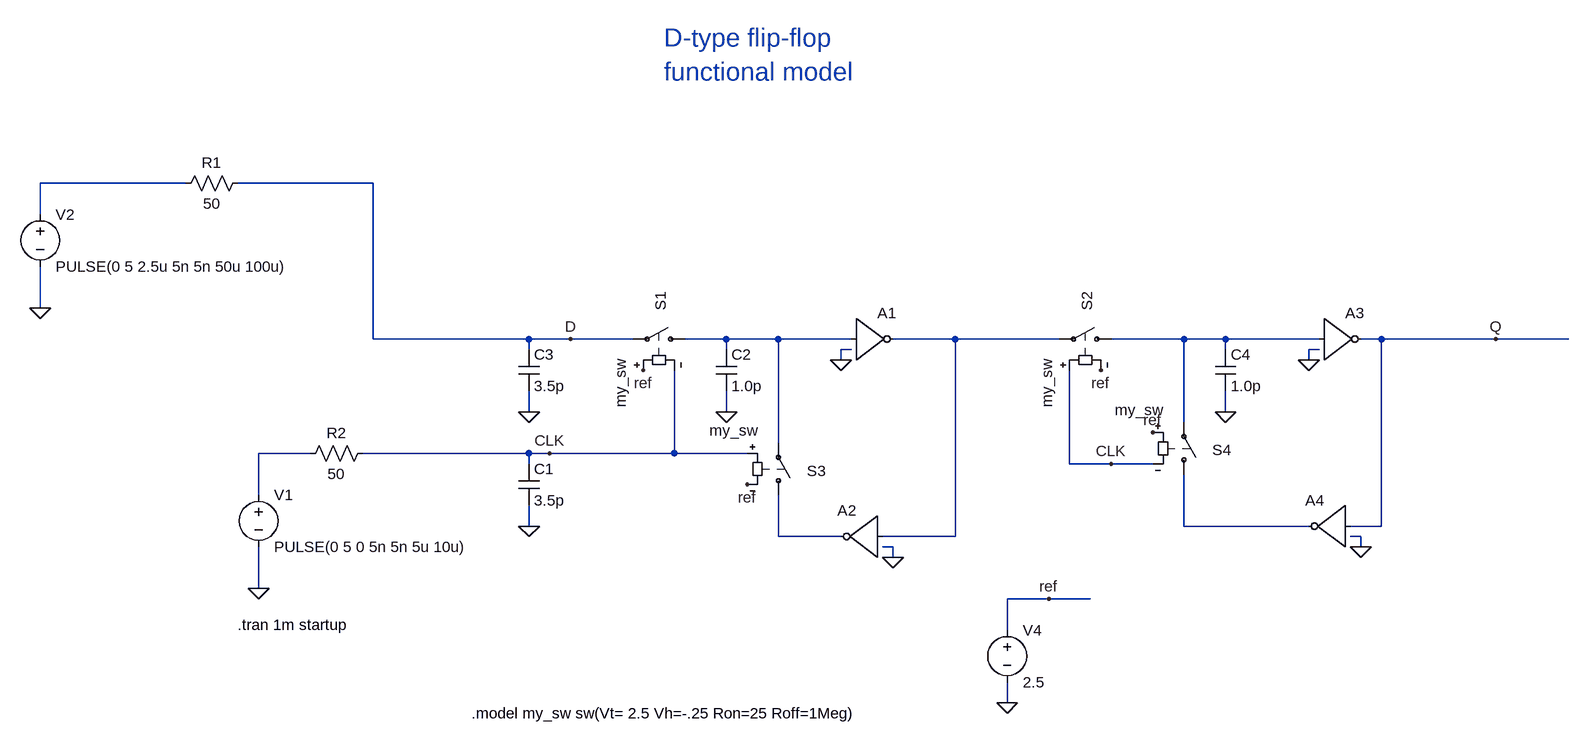
[diagram p0: schematic flip_flop_trans_gate.asc]
flip_flop_trans_gate.asc, the LTspice schematic file:
Version 4
SHEET 1 2948 680
WIRE 816 -528 592 -528
WIRE 1104 -528 896 -528
WIRE 592 -480 592 -528
WIRE 592 -336 592 -400
WIRE 1104 -288 1104 -528
WIRE 1344 -288 1104 -288
WIRE 1408 -288 1344 -288
WIRE 1504 -288 1408 -288
WIRE 1648 -288 1584 -288
WIRE 1728 -288 1648 -288
WIRE 1840 -288 1728 -288
WIRE 2000 -288 1904 -288
WIRE 2160 -288 2000 -288
WIRE 2352 -288 2240 -288
WIRE 2416 -288 2352 -288
WIRE 2560 -288 2416 -288
WIRE 2656 -288 2624 -288
WIRE 2832 -288 2656 -288
WIRE 2944 -288 2832 -288
WIRE 1344 -272 1344 -288
WIRE 1648 -272 1648 -288
WIRE 1840 -272 1824 -272
WIRE 2416 -272 2416 -288
WIRE 2560 -272 2544 -272
WIRE 1824 -256 1824 -272
WIRE 2544 -256 2544 -272
WIRE 1344 -176 1344 -208
WIRE 1648 -176 1648 -208
WIRE 2416 -176 2416 -208
WIRE 2352 -160 2352 -288
WIRE 1728 -128 1728 -288
WIRE 1008 -112 928 -112
WIRE 1344 -112 1088 -112
WIRE 1376 -112 1344 -112
WIRE 1568 -112 1568 -240
WIRE 1568 -112 1376 -112
WIRE 1680 -112 1568 -112
WIRE 1344 -96 1344 -112
WIRE 2176 -96 2176 -240
WIRE 2240 -96 2176 -96
WIRE 2304 -96 2240 -96
WIRE 928 -48 928 -112
WIRE 1344 0 1344 -32
WIRE 2352 0 2352 -80
WIRE 2544 0 2352 0
WIRE 2656 0 2656 -288
WIRE 2656 0 2608 0
WIRE 1728 16 1728 -48
WIRE 1824 16 1728 16
WIRE 2000 16 2000 -288
WIRE 2000 16 1888 16
WIRE 2624 16 2608 16
WIRE 1904 32 1888 32
WIRE 2624 32 2624 16
WIRE 1904 48 1904 32
WIRE 928 96 928 32
WIRE 2144 112 2080 112
WIRE 2208 112 2144 112
WIRE 2080 160 2080 112
WIRE 2080 272 2080 240
FLAG 928 96 0
FLAG 1344 0 0
FLAG 1344 -176 0
FLAG 2080 272 0
FLAG 2144 112 ref
FLAG 1824 -256 0
FLAG 1520 -240 ref
FLAG 1680 -64 ref
FLAG 2224 -240 ref
FLAG 2304 -144 ref
FLAG 1408 -288 D
FLAG 2832 -288 Q
FLAG 1376 -112 CLK
FLAG 2240 -96 CLK
FLAG 592 -336 0
FLAG 1648 -176 0
FLAG 2416 -176 0
FLAG 1904 48 0
FLAG 2544 -256 0
FLAG 2624 32 0
SYMBOL voltage 928 -64 R0
WINDOW 123 0 0 Left 0
WINDOW 39 0 0 Left 0
SYMATTR InstName V1
SYMATTR Value PULSE(0 5 0 5n 5n 5u 10u)
SYMBOL cap 1328 -96 R0
SYMATTR InstName C1
SYMATTR Value 3.5p
SYMBOL cap 1328 -272 R0
SYMATTR InstName C3
SYMATTR Value 3.5p
SYMBOL sw 1600 -288 M270
WINDOW 0 44 53 Left 2
WINDOW 3 -31 115 Right 2
SYMATTR InstName S1
SYMATTR Value my_sw
SYMBOL sw 2256 -288 M270
WINDOW 0 44 53 Left 2
WINDOW 3 -31 115 Right 2
SYMATTR InstName S2
SYMATTR Value my_sw
SYMBOL sw 1728 -32 M180
WINDOW 0 44 53 Left 2
WINDOW 3 -31 115 Right 2
SYMATTR InstName S3
SYMATTR Value my_sw
SYMBOL sw 2352 -64 M180
WINDOW 0 44 53 Left 2
WINDOW 3 -31 115 Right 2
SYMATTR InstName S4
SYMATTR Value my_sw
SYMBOL voltage 2080 144 R0
WINDOW 123 0 0 Left 0
WINDOW 39 0 0 Left 0
SYMATTR InstName V4
SYMATTR Value 2.5
SYMBOL voltage 592 -496 R0
WINDOW 123 0 0 Left 0
WINDOW 39 0 0 Left 0
SYMATTR InstName V2
SYMATTR Value PULSE(0 5 2.5u 5n 5n 50u 100u)
SYMBOL cap 1632 -272 R0
SYMATTR InstName C2
SYMATTR Value 1.0p
SYMBOL cap 2400 -272 R0
SYMATTR InstName C4
SYMATTR Value 1.0p
SYMBOL Digital\\inv 1840 -352 R0
SYMATTR InstName A1
SYMATTR SpiceLine Vhigh=5 Tfall=5n Trise=5n Td=12n ref=2.5
SYMATTR SpiceLine2 rhigh=1 rlow=1
SYMBOL Digital\\inv 1888 -48 M0
SYMATTR InstName A2
SYMATTR SpiceLine Vhigh=5 Tfall=5n Trise=5n Td=12n ref=2.5
SYMATTR SpiceLine2 rhigh=1 rlow=1
SYMBOL Digital\\inv 2560 -352 R0
SYMATTR InstName A3
SYMATTR SpiceLine Vhigh=5 Tfall=5n Trise=5n Td=12n ref=2.5
SYMATTR SpiceLine2 rhigh=1 rlow=1
SYMBOL Digital\\inv 2608 -64 M0
SYMATTR InstName A4
SYMATTR SpiceLine Vhigh=5 Tfall=5n Trise=5n Td=12n ref=2.5
SYMATTR SpiceLine2 rhigh=1 rlow=1
SYMBOL res 912 -544 R90
WINDOW 0 0 56 VBottom 2
WINDOW 3 32 56 VTop 2
SYMATTR InstName R1
SYMATTR Value 50
SYMBOL res 1104 -128 R90
WINDOW 0 0 56 VBottom 2
WINDOW 3 32 56 VTop 2
SYMATTR InstName R2
SYMATTR Value 50
TEXT 896 152 Left 2 !.tran 1m startup
TEXT 1256 288 Left 2 !.model my_sw sw(Vt= 2.5 Vh=-.25 Ron=25 Roff=1Meg)
TEXT 1552 -752 Left 4 ;D-type flip-flop\nfunctional model

The netlist it stands for:
* flip_flop_trans_gate.asc
V1 N005 0 PULSE(0 5 0 5n 5n 5u 10u)
C1 CLK 0 3.5p
C3 D 0 3.5p
S1 N002 D ref CLK my_sw
S2 N004 N003 CLK ref my_sw
S3 N007 N002 CLK ref my_sw
S4 N006 N004 ref CLK my_sw
V4 ref 0 2.5
V2 N001 0 PULSE(0 5 2.5u 5n 5n 50u 100u)
C2 N002 0 1.0p
C4 N004 0 1.0p
A1 N002 0 0 0 0 N003 0 0 BUF Vhigh=5 Tfall=5n Trise=5n Td=12n ref=2.5 rhigh=1 rlow=1
A2 N003 0 0 0 0 N007 0 0 BUF Vhigh=5 Tfall=5n Trise=5n Td=12n ref=2.5 rhigh=1 rlow=1
A3 N004 0 0 0 0 Q 0 0 BUF Vhigh=5 Tfall=5n Trise=5n Td=12n ref=2.5 rhigh=1 rlow=1
A4 Q 0 0 0 0 N006 0 0 BUF Vhigh=5 Tfall=5n Trise=5n Td=12n ref=2.5 rhigh=1 rlow=1
R1 D N001 50
R2 CLK N005 50
.tran 1m startup
.model my_sw sw(Vt= 2.5 Vh=-.25 Ron=25 Roff=1Meg)
* D-type flip-flop
* functional model
.backanno
.end